# EAGLE design HWCR (EAGLE 9.6.2)
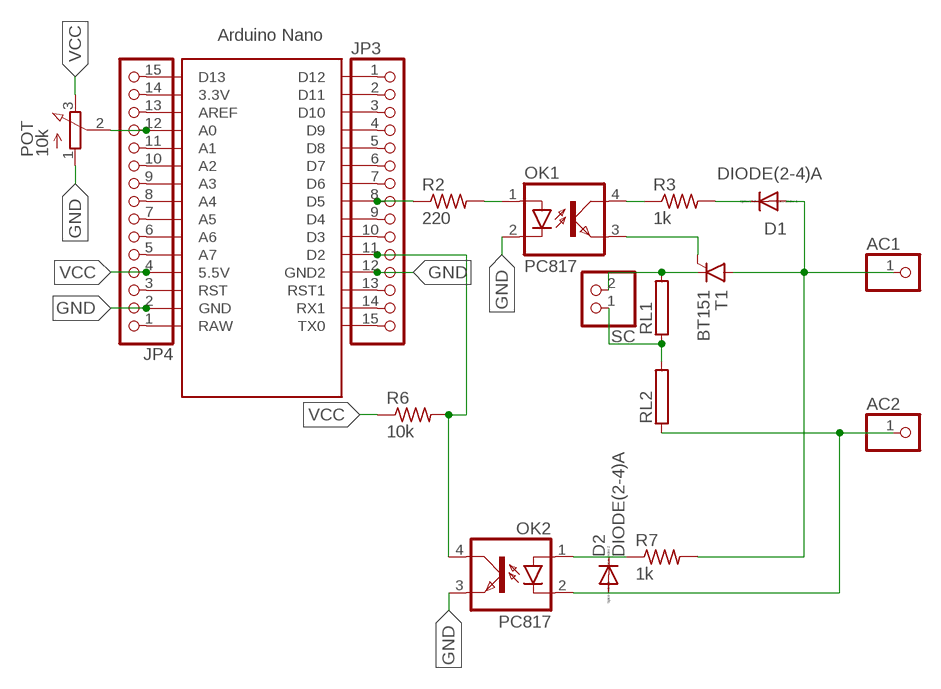
[diagram p0: schematic, sheet 1]

## Parts
AC1  PINHD-1X1  [1X01]
AC2  PINHD-1X1  [1X01]
D1  DIODE(2-4)A  [DO35-10]
D2  DIODE(2-4)A  [DO35-10]
JP3  PINHD-1X15  [1X15]
JP4  PINHD-1X15  [1X15]
OK1  PC817  [DIL04]
OK2  PC817  [DIL04]
POT  10k  POTENTIOMETER  [3RP/1610N]
R2  220  R-US_0207/10  [0207/10]
R3  1k  R-US_0207/10  [0207/10]
R6  10k  R-US_0207/10  [0207/10]
R7  1k  R-US_0207/10  [0207/10]
RL1  RKP296  [KP296]
RL2  RKP296  [KP296]
SC  PINHD-1X2  [1X02]
T1  BT151  [TO220CL]
U$1  ARDUINO_NANO  [NANO]

## Nets
GND: JP3.12 JP4.2 OK1.2(C) OK2.3(EMIT) POT.1(A) U$1.GND U$1.GND1(GND2)
N$1: JP4.12 POT.2(S) U$1.A0
N$2: JP3.1 U$1.D12
N$3: JP3.2 U$1.D11
N$4: JP3.3 U$1.D10
N$5: JP3.4 U$1.D9
N$6: JP3.5 U$1.D8
N$7: JP3.6 U$1.D7
N$8: JP3.7 U$1.D6
N$9: JP3.8 R2.1 U$1.D5
N$10: JP3.9 U$1.D4
N$11: JP3.10 U$1.D3
N$12: JP3.11 OK2.4(COL) R6.2 U$1.D2
N$13: OK1.1(A) R2.2
N$14: JP3.13 U$1.RST1
N$15: JP3.14 U$1.RX1
N$16: JP3.15 U$1.TX0
N$17: JP4.1 U$1.RAW
N$18: D1.C R3.2
N$19: JP4.3 U$1.RST
N$20: OK1.4(COL) R3.1
N$21: JP4.5 U$1.A7
N$22: JP4.6 U$1.A6
N$23: JP4.7 U$1.A5
N$24: JP4.8 U$1.A4
N$25: JP4.9 U$1.A3
N$26: JP4.10 U$1.A2
N$27: JP4.11 U$1.A1
N$28: JP4.13 U$1.AREF
N$29: JP4.14 U$1.3.3V
N$30: JP4.15 U$1.D13
N$31: OK1.3(EMIT) T1.G
N$32: RL1.1 RL2.2 SC.1
N$33: RL1.2 SC.2 T1.C
N$34: AC2.1 D2.A OK2.2(C) RL2.1
N$35: AC1.1 D1.A R7.2 T1.A
N$36: D2.C OK2.1(A) R7.1
VCC: JP4.4 POT.3(E) R6.1 U$1.5V(5.5V)

## Library data of the parts
AC1 AC2 = MIA_LIBRARY-2-2-2:PINHD-1X1: PIN HEADER
D1 D2 = MIA_LIBRARY-2-2-2:DIODE(2-4)A: DIODE high speed (Philips)
JP3 JP4 = MIA_LIBRARY-2-2-2:PINHD-1X15: PIN HEADER
OK1 OK2 = optocoupler:PC817: SHARP OPTO COUPLER; MPN: PC817X4J000F; OC_FARNELL: 9707727; OC_NEWARK: 97K7059
POT = MIA_LIBRARY-2-2-2:POTENTIOMETER: 16mm Potentiometer one level Source: http://www.alphapotentiometers.net/html/16mm_pot_2.html
R2 R3 R6 R7 = rcl:R-US_: RESISTOR, American symbol; SPICEPREFIX: R
RL1 RL2 = resistor-power:R: Power Resitor; OC_FARNELL: unknown; OC_NEWARK: unknown
SC = MIA_LIBRARY-2-2-2:PINHD-1X2: PIN HEADER
T1 = triac:BT151: THYRISTOR
U$1 = MIA_LIBRARY-2-2-2:ARDUINO_NANO: Arduino Nano

## Board
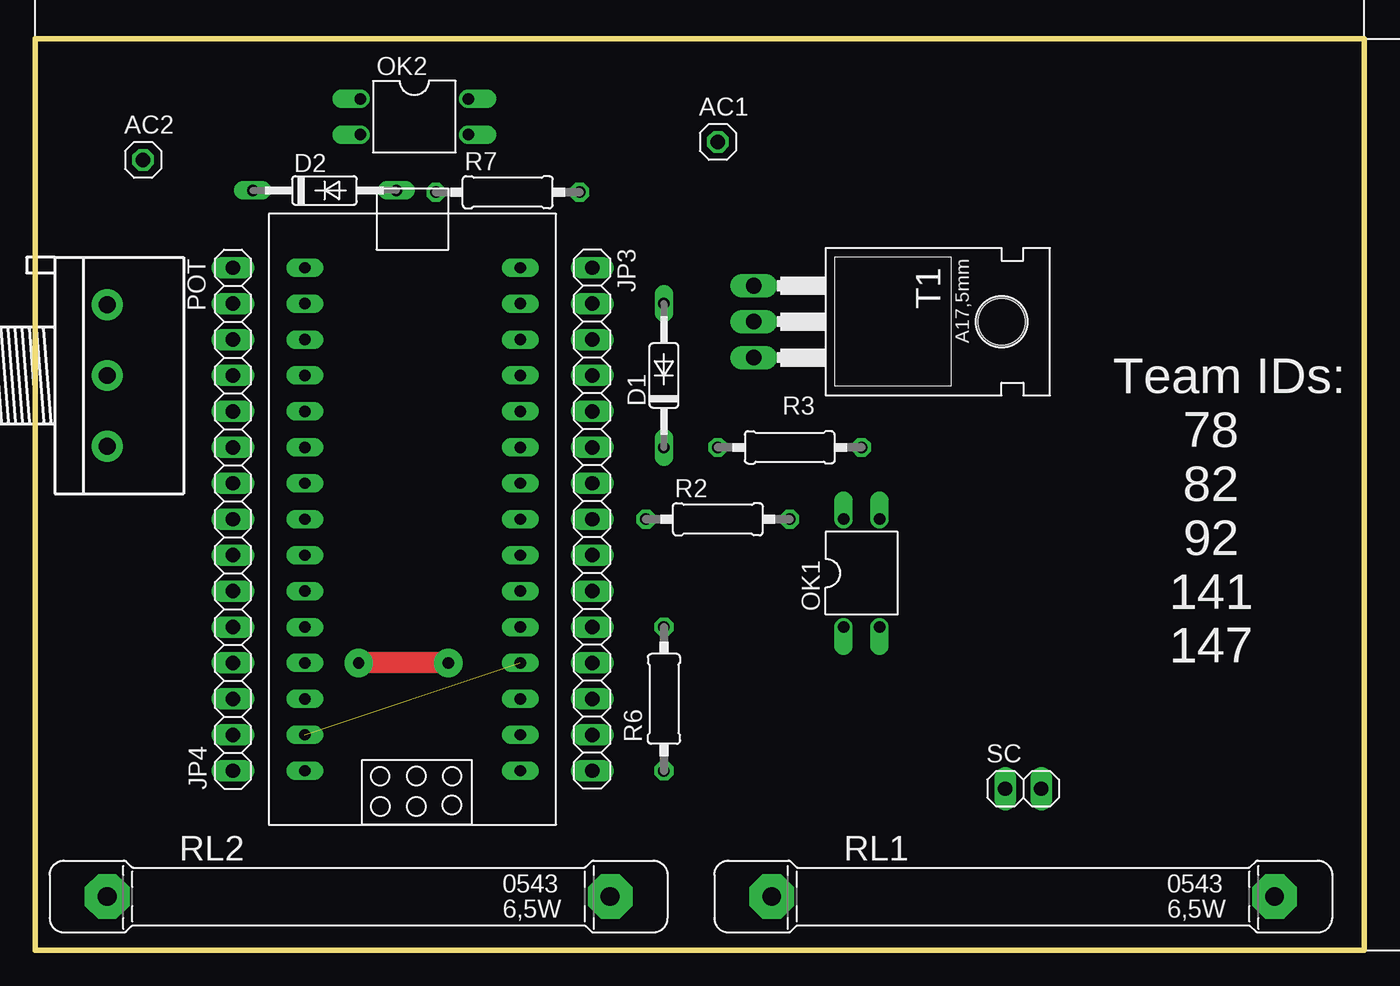
[diagram p1: board, top side]
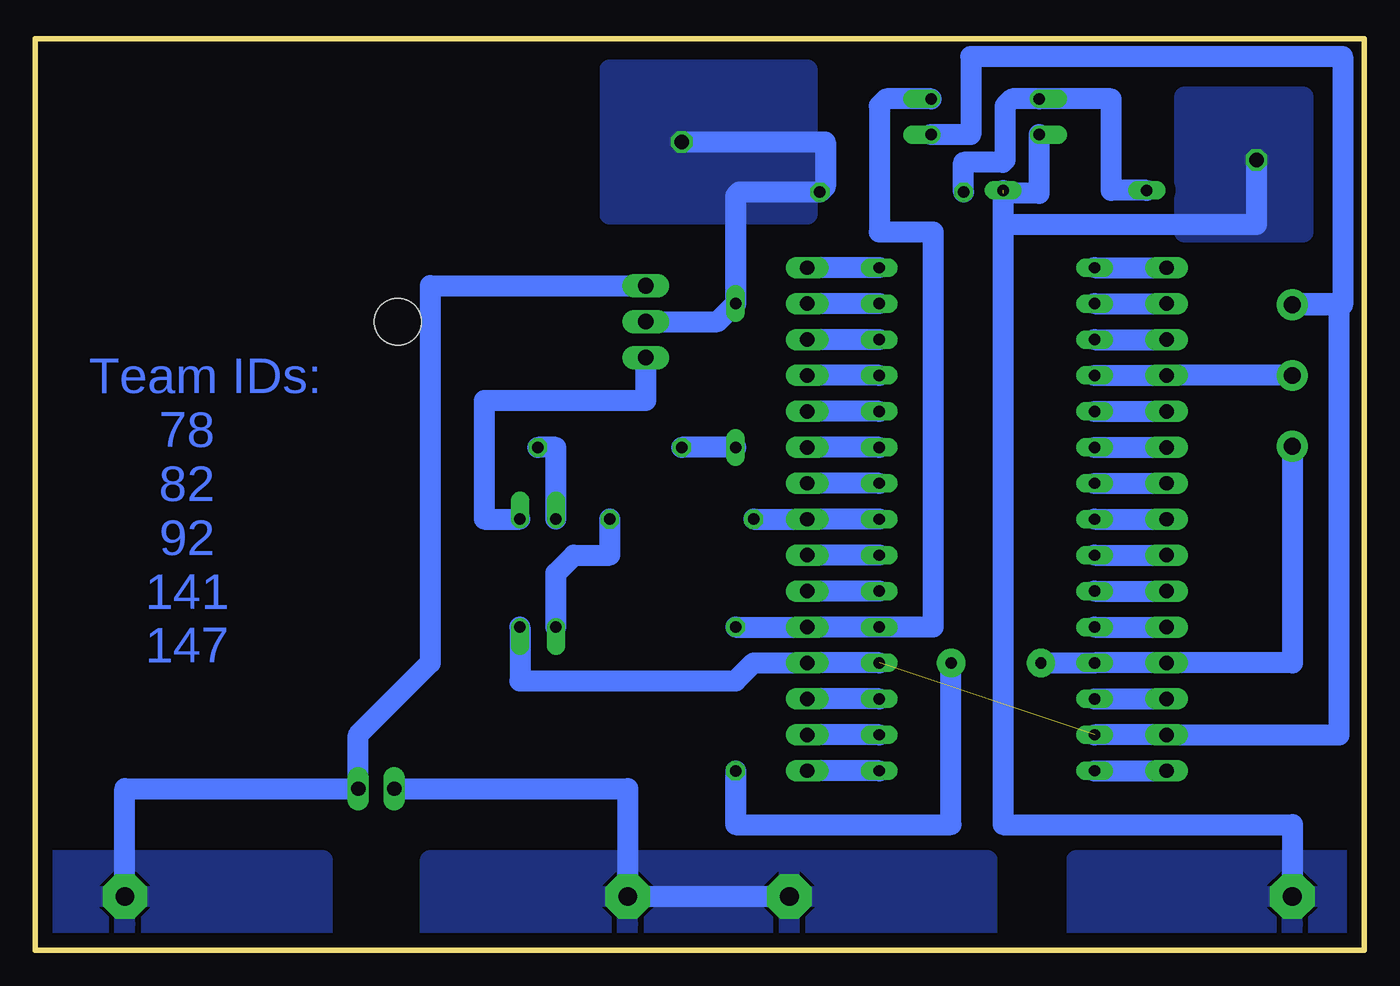
[diagram p2: board, bottom side, seen from below]

Size 93.96 x 64.44 mm. Coordinates in mm from the lower left corner, seen from the top.
Outline: 0,0 93.96,0 93.96,64.44 0,64.44 0,0
Copper layers (1*16): Top 0.035mm / dielectric 1.5mm / Bottom 0.035mm
Design rules "default *": minimum track width 1mm, minimum drill 0.35mm, track to track 0.7mm, track to pad 0.7mm, pad to pad 6mil, via to via 6mil, smd to smd 6mil, copper to edge 40mil, drill to drill 6mil, minimum pad ring 10mil, minimum via ring 8mil, stop-mask expansion 4mil, vias tented up to drill 0mil, thermal gap 10mil

### Footprints (pad centres in the part's own frame; a part is rotated, then mirrored left to right if it is on the bottom)
1X01 = drill 1.016 octagon: 1 0,0
DO35-10 = drill 0.813 long: A 5.08,0; C -5.08,0
1X15 = drill 1.016 long: 1 -17.78,0; 2 -15.24,0; 3 -12.7,0; 4 -10.16,0; 5 -7.62,0; 6 -5.08,0; 7 -2.54,0; 8 0,0; 9 2.54,0; 10 5.08,0; 11 7.62,0; 12 10.16,0; 13 12.7,0; 14 15.24,0; 15 17.78,0
DIL04 = drill 0.813 offset: 1 -1.27,-3.81; 2 1.27,-3.81; 3 1.27,3.81; 4 -1.27,3.81
3RP/1610N = drill 1.2 pad 2.184: 1 -5,0; 2 0,0; 3 5,0
0207/10 = drill 0.813 octagon: 1 -5.08,0; 2 5.08,0
KP296 = drill 1.321 pad 3.15 octagon: 1 -17.78,0; 2 17.78,0
1X02 = drill 1.016 long: 1 -1.27,0; 2 1.27,0
TO220CL = drill 1.118 long: A 0,-6.35; C -2.54,-6.35; G 2.54,-6.35 | hole 3.302: 0,11.176
NANO = drill 0.8 long: 3.3V -10.16,24.13; 5V -10.16,-1.27; A0 -10.16,19.05; A1 -10.16,16.51; A2 -10.16,13.97; A3 -10.16,11.43; A4 -10.16,8.89; A5 -10.16,6.35; A6 -10.16,3.81; A7 -10.16,1.27; AREF -10.16,21.59; D2 5.08,1.27; D3 5.08,3.81; D4 5.08,6.35; D5 5.08,8.89; D6 5.08,11.43; D7 5.08,13.97; D8 5.08,16.51; D9 5.08,19.05; D10 5.08,21.59; D11 5.08,24.13; D12 5.08,26.67; D13 -10.16,26.67; GND -10.16,-6.35; GND1 5.08,-1.27; RAW -10.16,-8.89; RST -10.16,-3.81; RST1 5.08,-3.81; RX1 5.08,-6.35; TX0 5.08,-8.89

### Placement (x,y rotation side)
AC1  48.26,57.15 0 top
AC2  7.62,55.88 0 top
D1  44.45,40.64 90 top
D2  20.45,53.72 0 top
JP3  39.37,30.48 270 top
JP4  13.97,30.48 90 top
OK1  58.42,26.67 0 top
OK2  26.8,58.93 270 top
POT  5.08,40.64 270 top
R2  48.26,30.48 0 top
R3  53.34,35.56 180 top
R6  44.45,17.78 90 top
R7  33.4,53.59 0 top
RL1  69.85,3.81 0 top
RL2  22.86,3.81 0 top
SC  69.85,11.43 0 top
T1  57.15,44.45 270 top
U$1  29.21,21.59 0 top

### Tracks (layer width: path | path; a pad name or v marks a point on that pad's centre or on a via)
GND  (1 unrouted)
  Bottom 1.5: U$1.GND JP4.2 1.77,15.24 1.77,45.72 5,45.72 POT.1 1.52,45.64 1.52,63.18 27.81,63.18 27.81,57.66 OK2.3 | U$1.GND1 JP3.12 43.18,20.32 44.45,19.05 59.69,19.05 OK1.2
N$1
  Bottom 1.5: U$1.A0 JP4.12 POT.2
N$2
  Bottom 1.5: U$1.D12 JP3.1
N$3
  Bottom 1.5: U$1.D11 JP3.2
N$4
  Bottom 1.5: U$1.D10 JP3.3
N$5
  Bottom 1.5: U$1.D9 JP3.4
N$6
  Bottom 1.5: U$1.D8 JP3.5
N$7
  Bottom 1.5: U$1.D7 JP3.6
N$8
  Bottom 1.5: U$1.D6 JP3.7
N$9
  Bottom 1.5: U$1.D5 JP3.8 R2.1
N$10
  Bottom 1.5: U$1.D4 JP3.9
N$11
  Bottom 1.5: U$1.D3 JP3.10
N$12
  Bottom 1.5: OK2.4 33.78,60.2 34.29,59.69 34.29,50.8 30.48,50.8 30.48,22.86 U$1.D2 JP3.11 R6.2
N$13
  Bottom 1.5: OK1.1 57.15,26.67 55.88,27.94 53.34,27.94 R2.2
N$14
  Bottom 1.5: U$1.RST1 JP3.13
N$15
  Bottom 1.5: U$1.RX1 JP3.14
N$16
  Bottom 1.5: U$1.TX0 JP3.15
N$17
  Bottom 1.5: U$1.RAW JP4.1
N$18
  Bottom 1.5: D1.C R3.2
N$19
  Bottom 1.5: U$1.RST JP4.3
N$20
  Bottom 1.5: OK1.4 57.15,35.56 R3.1
N$21
  Bottom 1.5: U$1.A7 JP4.5
N$22
  Bottom 1.5: U$1.A6 JP4.6
N$23
  Bottom 1.5: U$1.A5 JP4.7
N$24
  Bottom 1.5: U$1.A4 JP4.8
N$25
  Bottom 1.5: U$1.A3 JP4.9
N$26
  Bottom 1.5: U$1.A2 JP4.10
N$27
  Bottom 1.5: U$1.A1 JP4.11
N$28
  Bottom 1.5: U$1.AREF JP4.13
N$29
  Bottom 1.5: U$1.3.3V JP4.14
N$30
  Bottom 1.5: U$1.D13 JP4.15
N$31
  Bottom 1.5: T1.G 50.8,38.86 62.23,38.86 62.23,30.48 OK1.3
N$32
  Bottom 1.5: RL2.2 RL1.1 52.07,11.43 SC.1
  pour Bottom: 26.67,6.35 46.99,6.35 46.99,1.27 26.67,1.27
  pour Bottom: 46.99,6.35 66.04,6.35 66.04,1.27 46.99,1.27
N$33
  Bottom 1.5: RL1.2 87.63,11.43 SC.2 71.12,15.24 66.04,20.32 66.04,46.99 T1.C
  pour Bottom: 73.66,6.35 92.71,6.35 92.71,1.27 73.66,1.27
N$34  (1 unrouted)
  Bottom 1.5: OK2.2 22.99,53.51 25.53,53.51 | D2.A 25.53,51.31 | 25.53,51.31 25.53,8.89 5.08,8.89 RL2.1 | AC2.1 7.62,51.31 25.53,51.31
  pour Bottom: 4.32,60.33 12.7,60.33 12.7,50.8 4.32,50.8
  pour Bottom: 1.27,6.35 20.32,6.35 20.32,1.27 1.27,1.27
N$35
  Bottom 1.5: T1.A 45.72,44.45 D1.A 44.45,53.34 44.2,53.59 R7.2 38.1,53.98 38.1,57.15 AC1.1
  pour Bottom: 39.37,62.23 53.34,62.23 53.34,52.07 39.37,52.07
N$36
  Bottom 1.5: D2.C 17.91,53.72 17.91,60.2 OK2.1 24.89,60.2 25.4,59.69 25.4,55.88 25.57,55.71 28.32,55.71 R7.1
VCC  (via drill 0.8 pad 2)
  Top 1.5: v29.21,20.32 v22.86,20.32
  Bottom 1.5: POT.3 5.08,20.32 JP4.4 U$1.5V v22.86,20.32 | R6.1 44.45,8.89 29.21,8.89 v29.21,20.32

### Text on the board
Bottom: Team IDs: / 78 / 82 / 92 / 141 / 147
tPlace: Team IDs: / 78 / 82 / 92 / 141 / 147